# Altium schematic sheet LCD_Header.SchDoc: LCDDisplay
size B; Date: 2015-01-23; Author: Marcin Czajkowski; Organization: Marcin Czajkowski; Address1: SN: 3547684; Address2: ESE-Year2; Address3: Conestoga College; Address4: Project IV; DocumentNumber: 6; Revision: A; SheetNumber: 6; SheetTotal: 14
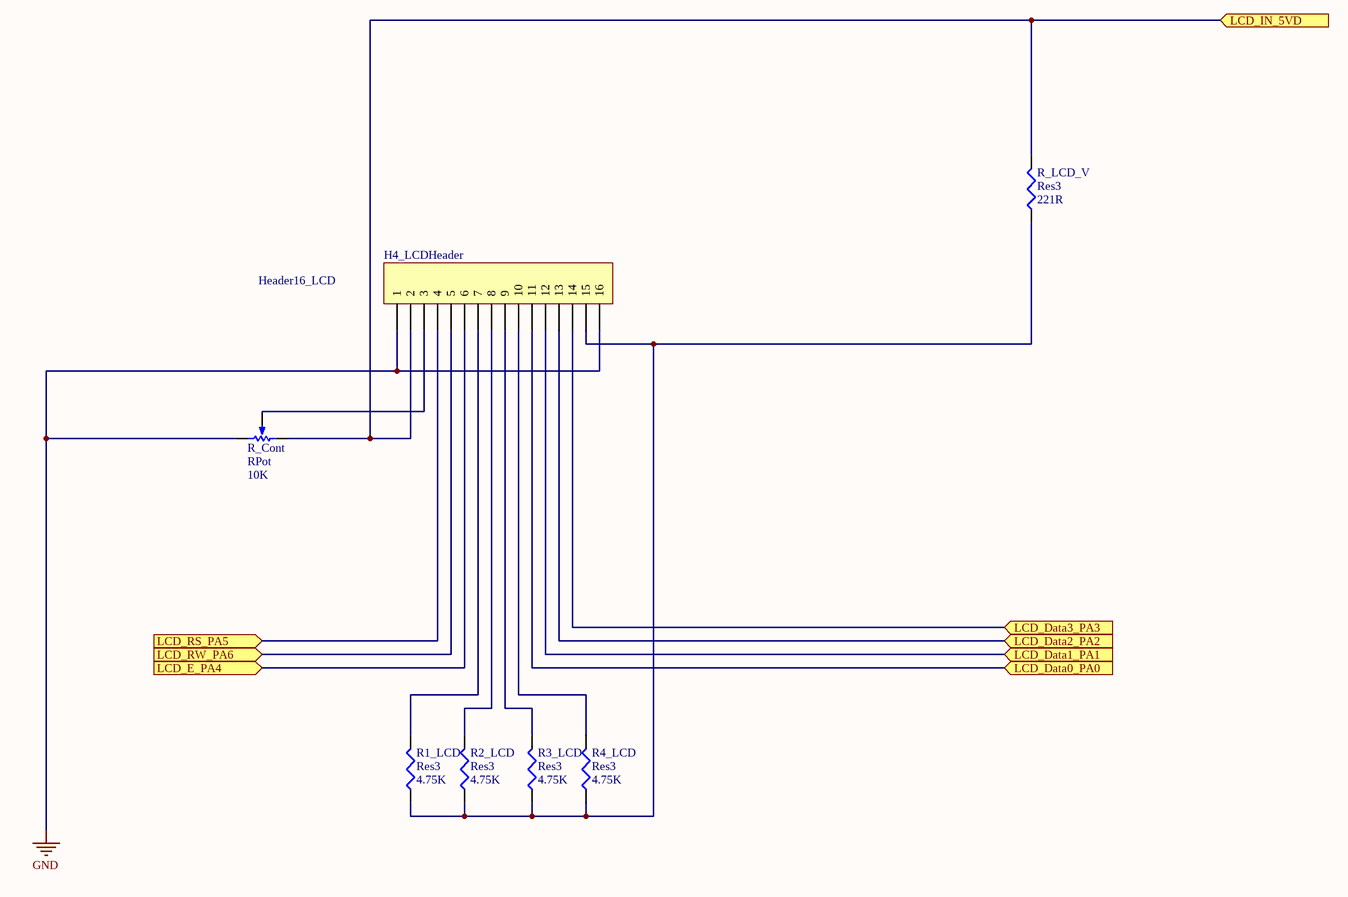
[diagram p0: LCD_Header.SchDoc]

## Parts
H4_LCDHeader  Header16_LCD  [HDR1X16_LCD]
R1_LCD  Res3  value 4.75K  [RESC2112X05M]
R2_LCD  Res3  value 4.75K  [RESC2112X05M]
R3_LCD  Res3  value 4.75K  [RESC2112X05M]
R4_LCD  Res3  value 4.75K  [RESC2112X05M]
R_Cont  RPot  value 10K  [BOURNS_3386F]
R_LCD_V  Res3  value 221R  [RESC2112X05M]

## Ports
LCD_Data0_PA0 (in), LCD_Data1_PA1 (in), LCD_Data2_PA2 (in), LCD_Data3_PA3 (in), LCD_E_PA4 (in), LCD_IN_5VD (in), LCD_RS_PA5 (in), LCD_RW_PA6 (in)

## Nets
GND: H4_LCDHeader.1 H4_LCDHeader.16 R_Cont.3(BOT)
LCD_Data0_PA0: H4_LCDHeader.11 ; port LCD_Data0_PA0
LCD_Data1_PA1: H4_LCDHeader.12 ; port LCD_Data1_PA1
LCD_Data2_PA2: H4_LCDHeader.13 ; port LCD_Data2_PA2
LCD_Data3_PA3: H4_LCDHeader.14 ; port LCD_Data3_PA3
LCD_E_PA4: H4_LCDHeader.6 ; port LCD_E_PA4
LCD_IN_5VD: H4_LCDHeader.2 R_Cont.1(TOP) R_LCD_V.2 ; port LCD_IN_5VD
LCD_RS_PA5: H4_LCDHeader.4 ; port LCD_RS_PA5
LCD_RW_PA6: H4_LCDHeader.5 ; port LCD_RW_PA6
NetH4_LCDHeader_3: H4_LCDHeader.3 R_Cont.2(TAP)
NetH4_LCDHeader_7: H4_LCDHeader.7 R1_LCD.2
NetH4_LCDHeader_8: H4_LCDHeader.8 R2_LCD.2
NetH4_LCDHeader_9: H4_LCDHeader.9 R3_LCD.2
NetH4_LCDHeader_10: H4_LCDHeader.10 R4_LCD.2
NetH4_LCDHeader_15: H4_LCDHeader.15 R1_LCD.1 R2_LCD.1 R3_LCD.1 R4_LCD.1 R_LCD_V.1

## Notes on the sheet
- ESE
- is the sole property of ESE. Any reproduction
- The Information Contained in this drawing
- Schematic P/N and Name
- Sheet Name
- 299 Doon Valley Drive
- Kitchener, ON N2G 4M4
- Canada
- Approved
- in part or in whole without the written
- permission of ESE is strictly prohibited.
- APPROVALS
- DATE
- Size
- Scale
- B
- NTS
- Bare PCB P/N
- Date
- Sheet
- Rev.
- Checked
- Engineer
- of

## Library data of the parts
H4_LCDHeader = Header16_LCD: Header, 16-Pin Female; MPN: PPPC161LFBN-RC; PN: S7049-ND; URL: http://www.digikey.ca/product-detail/en/PPPC161LFBN-RC/S7049-ND
R1_LCD R2_LCD R3_LCD R4_LCD = Resistor_4.75K: RES SMD 4.75K OHM 1% 1/8W 0805; MPN: CRCW08054K75FKEA; PN: 541-4.75KCCT-ND; Name: Resistor_4.75K; URL: http://www.digikey.ca/product-detail/en/CRCW08054K75FKEA/541-4.75KCCT-ND
R_Cont = RPot: Potentiometer; Sim Note: Enter the Resistance value and the set point into parameter fields.; Set Position: 0.5; PN: 3352T-103LF-ND; Published: 8-Jun-2000; LatestRevisionDate: 17-Jul-2002; LatestRevisionNote: Re-released for DXP Platform.; PackageReference: VR5; Publisher: Altium Limited; PackageDescription: Variable Resistor, Thru-Hole; 3 Leads; URL: http://www.digikey.ca/product-detail/en/3352T-1-103LF/3352T-103LF-ND/1088341
R_LCD_V = Resistor_221R: RES SMD 221R OHM 1% 1/8W 0805; MPN: CRCW0805221RFKEA; PN: 541-221CCT-ND; Name: Resistor_221R; URL: http://www.digikey.ca/product-detail/en/CRCW0805221RFKEA/541-221CCT-ND